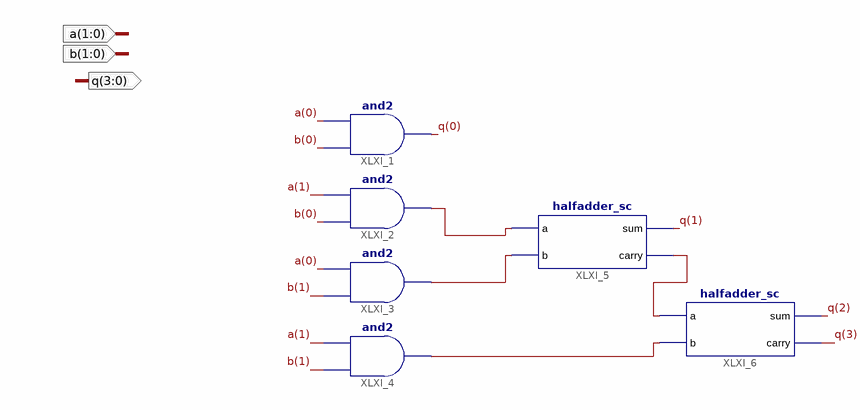
[diagram p0: schematic sheet 1]
// Xilinx ISE schematic vedic2_x_2_sc.sch (spartan6) as structural Verilog: 6 symbols, 3 ports
module vedic2_x_2_sc (
  input  [1:0] a,
  input  [1:0] b,
  output [3:0] q
);

  wire XLXN_13, XLXN_14, XLXN_19, XLXN_24;

  and XLXI_1 (q[0], b[0], a[0]);
  and XLXI_2 (XLXN_24, b[0], a[1]);
  and XLXI_3 (XLXN_13, b[1], a[0]);
  and XLXI_4 (XLXN_14, b[1], a[1]);
  halfadder_sc XLXI_5 (.a(XLXN_24), .b(XLXN_13), .sum(q[1]), .carry(XLXN_19));
  halfadder_sc XLXI_6 (.a(XLXN_19), .b(XLXN_14), .sum(q[2]), .carry(q[3]));
endmodule
